# EAGLE design Final Schematic (EAGLE 7.7.0)
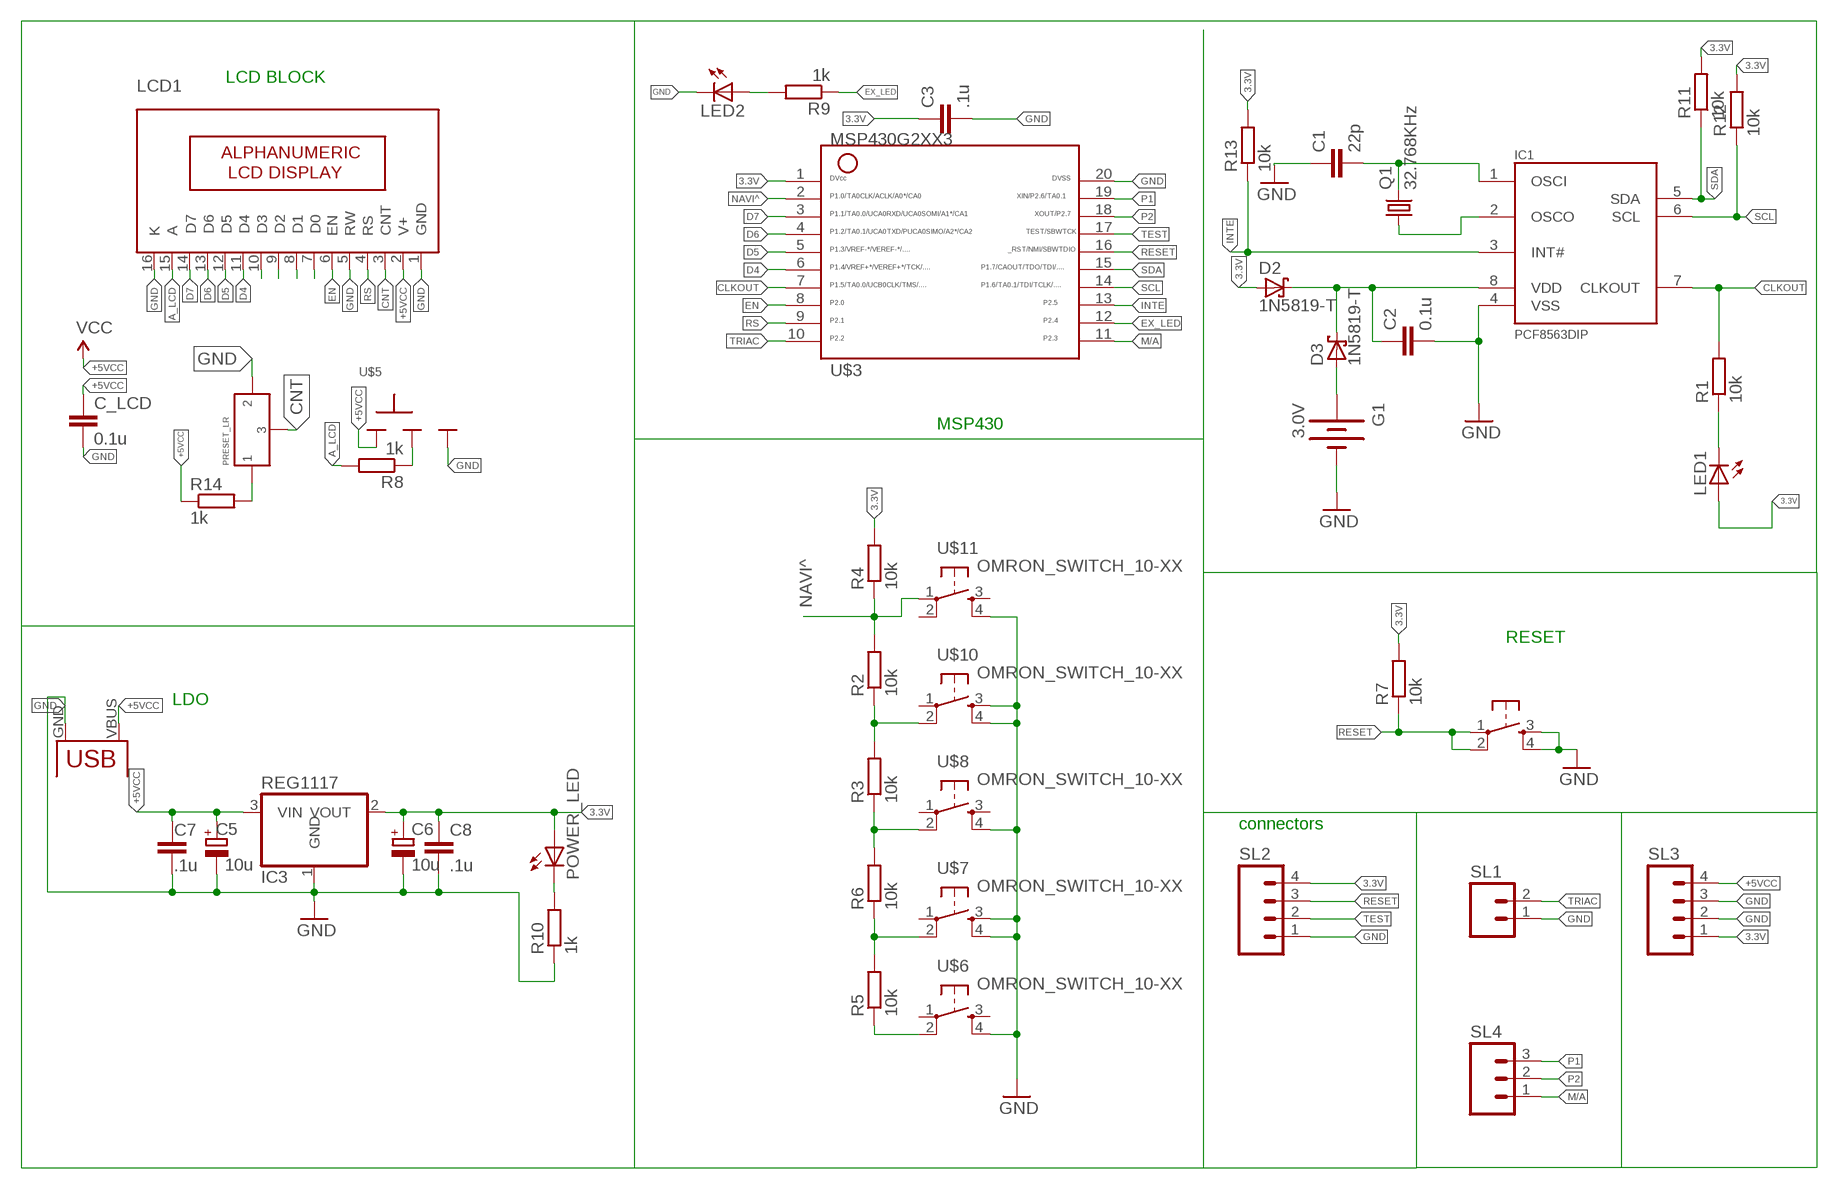
[diagram p0: schematic, sheet 1]

## Parts
C1  22p  C-EU025-025X050  [C025-025X050]
C2  0.1u  C-EU025-025X050  [C025-025X050]
C3  .1u  C-EU025-025X050  [C025-025X050]
C5  10u  CPOL-EUE2.5-5  [E2,5-5]
C6  10u  CPOL-EUE2.5-5  [E2,5-5]
C7  .1u  C-EU025-025X050  [C025-025X050]
C8  .1u  C-EU025-025X050  [C025-025X050]
C_LCD  0.1u  C-EU025-025X050  [C025-025X050]
D2  1N5819-T  [DO41-7.6]
D3  1N5819-T  [DO41-7.6]
G1  3.0V  BATTERY20PTH  [BATTCOM_20MM_PTH]
IC1  PCF8563DIP  [DIL08]
IC3  REG1117  [SOT223]
LCD1  16X2LCD  [16X2_LCD]
LED1  LED3MM  [LED3MM]
LED2  LED3MM  [LED3MM]
POWER_LED  LED3MM  [LED3MM]
Q1  32.768KHz  CRYSTALTC26H  [TC26H]
R1  10k  R-EU_0207/7  [0207/7]
R2  10k  R-EU_0207/7  [0207/7]
R3  10k  R-EU_0207/7  [0207/7]
R4  10k  R-EU_0207/7  [0207/7]
R5  10k  R-EU_0207/7  [0207/7]
R6  10k  R-EU_0207/7  [0207/7]
R7  10k  R-EU_0207/7  [0207/7]
R8  1k  R-EU_0207/7  [0207/7]
R9  1k  R-EU_0207/10  [0207/10]
R10  1k  R-EU_0207/7  [0207/7]
R11  10k  R-EU_0207/7  [0207/7]
R12  10k  R-EU_0207/10  [0207/10]
R13  10k  R-EU_0207/7  [0207/7]
R14  1k  R-EU_0207/7  [0207/7]
SL1  M02  [02P]
SL2  M04  [04P]
SL3  M04  [04P]
SL4  M03  [03P]
U$1  PRESET_LR  [PRESET_LR]
U$2  USB(POWER)  [USB(POWER)]
U$3  MSP430G2553DIP20  [G2553-DIP20]
U$5  SLIDESWITCH-BIG  [BIGSWITCH]
U$6  OMRON_SWITCH_10-XX  [B3F-10XX]
U$7  OMRON_SWITCH_10-XX  [B3F-10XX]
U$8  OMRON_SWITCH_10-XX  [B3F-10XX]
U$9  OMRON_SWITCH_10-XX  [B3F-10XX]
U$10  OMRON_SWITCH_10-XX  [B3F-10XX]
U$11  OMRON_SWITCH_10-XX  [B3F-10XX]

## Nets
3.3V: C3.1 C6.+ C8.1 D2.A IC3.2(VOUT) LED1.A POWER_LED.A R4.2 R7.2 R11.2 R12.2 R13.2 SL2.4 SL3.1 U$3.1
+5VCC: C5.+ C7.1 C_LCD.1 IC3.3(VIN) LCD1.2(V+) R14.1 SL3.4 U$2.VBUS(VCC) U$5.1 ; supply symbol labelled VCC
A_LCD: LCD1.15(A) R8.2
CLKOUT: IC1.7(CLKOUT) R1.2 U$3.7
CNT: LCD1.3(CNT) U$1.P$3
D4: LCD1.11(D4) U$3.6
D5: LCD1.12(D5) U$3.5
D6: LCD1.13(D6) U$3.4
D7: LCD1.14(D7) U$3.3
EN: LCD1.6(EN) U$3.8
EX_LED: R9.1 U$3.12
GND: C1.1 C2.2 C3.2 C5.- C6.- C7.2 C8.2 C_LCD.2 G1.2(-) IC1.4(VSS) IC3.1(GND) LCD1.1(GND) LCD1.5(RW) LCD1.16(K) LED2.K(C) R10.1 SL1.1 SL2.1 SL3.2 SL3.3 U$1.P$2 U$2.GND U$3.20 U$5.3 U$6.4(S1) U$7.3(S) U$7.4(S1) U$8.4(S1) U$9.3(S) U$9.4(S1) U$10.3(S) U$10.4(S1) U$11.4(S1)
INTE: IC1.3(INT#) R13.1 U$3.13
M/A: SL4.1 U$3.11
N$1: R8.1 U$5.2
N$3: LED2.A R9.2
N$5: LED1.K(C) R1.1
N$6: R14.2 U$1.P$1
N$10: R5.1 U$6.2(P1)
N$13: R2.1 R3.2 U$10.2(P1)
N$14: POWER_LED.K(C) R10.2
N$16: R3.1 R6.2 U$8.2(P1)
N$17: C2.1 D2.C D3.C IC1.8(VDD)
N$18: C1.2 IC1.1(OSCI) Q1.2
N$19: IC1.2(OSCO) Q1.1
N$20: D3.A G1.1(+)
N$21: LCD1.10(D3)
N$22: LCD1.9(D2)
N$23: LCD1.8(D1)
N$24: LCD1.7(D0)
N$25: R5.2 R6.1 U$7.2(P1)
NAVI^: R2.2 R4.1 U$3.2 U$11.1(P)
P1: SL4.3 U$3.19
P2: SL4.2 U$3.18
RESET: R7.1 SL2.3 U$3.16 U$9.1(P) U$9.2(P1)
RS: LCD1.4(RS) U$3.9
SCL: IC1.6(SCL) R12.1 U$3.14
SDA: IC1.5(SDA) R11.1 U$3.15
TEST: SL2.2 U$3.17
TRIAC: SL1.2 U$3.10
Unconnected: U$6.1(P) U$6.3(S) U$7.1(P) U$8.1(P) U$8.3(S) U$10.1(P) U$11.2(P1) U$11.3(S)

## Notes on the sheet
- LCD BLOCK
- MSP430
- RESET
- LDO
- connectors

## Library data of the parts
C1 C2 = rcl:C-EU: CAPACITOR, European symbol
C3 C7 C8 C_LCD = cpo_sdjhjasjhasjf:C-EU: CAPACITOR, European symbol
C5 C6 = cpo_sdjhjasjhasjf:CPOL-EU: POLARIZED CAPACITOR, European symbol
D2 D3 = diode:1N581*: 1.0A SCHOTTKY BARRIER RECTIFIER Source: http://www.diodes.com/datasheets/ds23001.pdf
G1 = SparkFun-Electromechanical:BATTERY: Battery Holders Various common sizes : AA, AAA, 18650 (PRT-12895), 20mm coin cell and 12mm coin cell. 20MM_4LEGS, BATT-10373
IC1 = CEDT_JANUARY_2015_v5:PCF8563
IC3 = CEDT_JANUARY_2015_v5:REG1117: 800mA and 1A Low Dropout (LDO) Positive Regulator 1.8V, 2.5V, 2.85V, 3.3V, 5V, and Adj
LCD1 = CEDT_JANUARY_2015_v5:16X2LCD: ALPHANUMERIC-LCD
LED1 = cpo_sdjhjasjhasjf:LED
LED2 POWER_LED = CEDT_JANUARY_2015_v5:LED
Q1 = CEDT_JANUARY_2015_v5:CRYSTAL: Crystals Various standard crystals. Proven footprints. Spark Fun Electronics SKU : COM-00534
R1-R7 R9-R13 = resistor:R-EU_: RESISTOR, European symbol
R8 = cpo_sdjhjasjhasjf:R-EU_: RESISTOR, European symbol
R14 = code practice oscillator:R-EU_: RESISTOR, European symbol
SL1 = con-amp-quick:M02: AMP QUICK CONNECTOR; OC_FARNELL: unknown; OC_NEWARK: unknown
SL2 SL3 = con-amp-quick:M04: AMP QUICK CONNECTOR; OC_FARNELL: unknown; OC_NEWARK: unknown
SL4 = con-amp-quick:M03: AMP QUICK CONNECTOR; OC_FARNELL: unknown; OC_NEWARK: unknown
U$1 = CEDT_JANUARY_2015_v5:PRESET_LR
U$2 = CEDT_JANUARY_2015_v5:USB(POWER)
U$3 = CEDT_JANUARY_2015_v5:MSP430G2553
U$5 = CEDT_JANUARY_2015_v5:SLIDESWITCH
U$6-U$8 U$10 U$11 = cpo_sdjhjasjhasjf:OMRON_SWITCH
U$9 = CEDT_JANUARY_2015_v5:OMRON_SWITCH

## Board
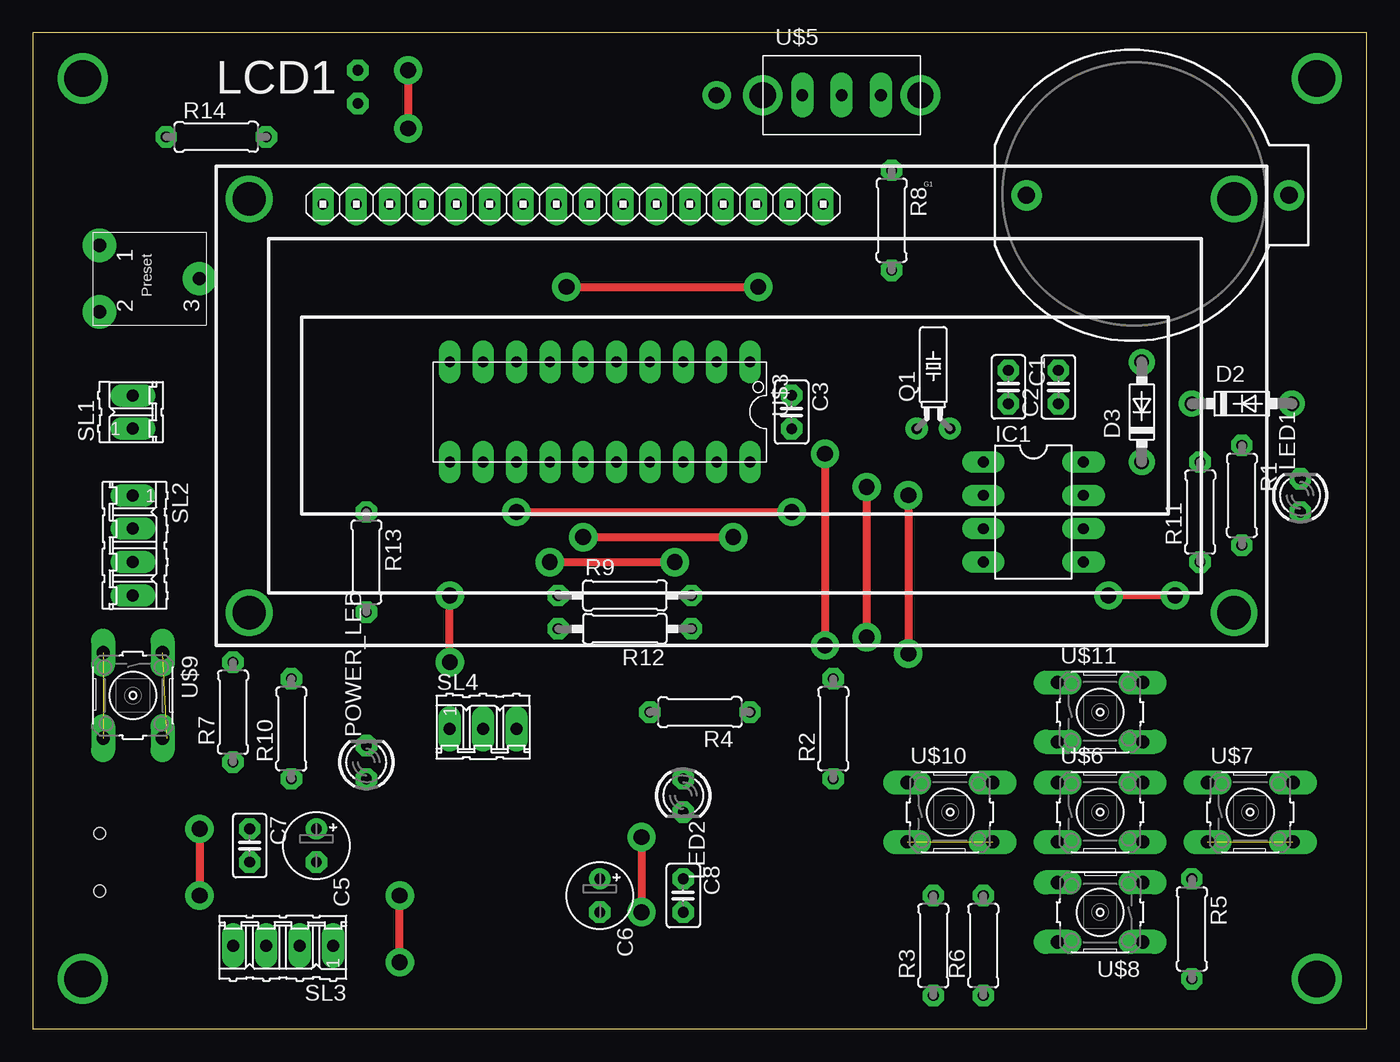
[diagram p1: board, top side]
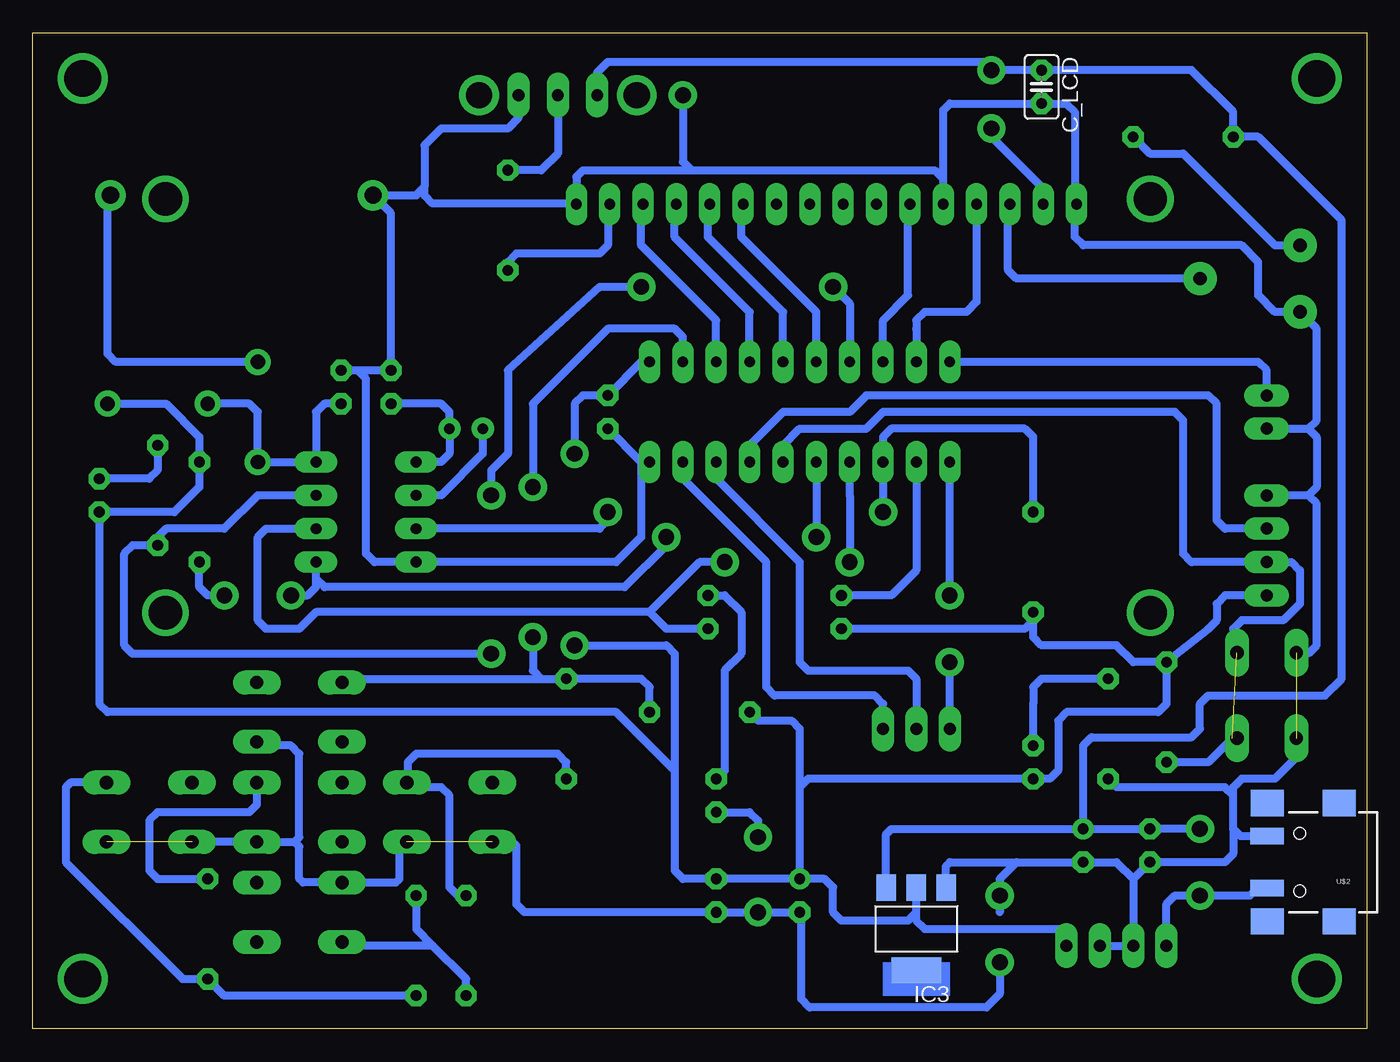
[diagram p2: board, bottom side, seen from below]

Size 101.58 x 75.87 mm. Coordinates in mm from the lower left corner, seen from the top.
Outline: 0,0 101.58,0 101.58,75.87 0,75.87 0,0
Copper layers (1*16): Top 0.035mm / dielectric 1.5mm / Bottom 0.035mm
Design rules "default *": minimum track width 16mil, minimum drill 24mil, track to track 16mil, track to pad 16mil, pad to pad 16mil, via to via 16mil, smd to smd 8mil, copper to edge 40mil, drill to drill 8mil, minimum pad ring 16mil, minimum via ring 16mil, stop-mask expansion 4mil, vias tented up to drill 0mil, thermal gap 10mil

### Footprints (pad centres in the part's own frame; a part is rotated, then mirrored left to right if it is on the bottom)
C025-025X050 = drill 0.813 octagon: 1 -1.27,0; 2 1.27,0
E2,5-5 = drill 0.813 pad 1.6: + -1.27,0 | drill 0.813 pad 1.6 octagon: - 1.27,0
DO41-7.6 = drill 1.1 pad 1.7: A 3.81,0; C -3.81,0
BATTCOM_20MM_PTH = drill 1.3: 1 11.85,0; 2 -8.15,0
DIL08 = drill 0.813 long: 1 -3.81,-3.81; 2 -1.27,-3.81; 3 1.27,-3.81; 4 3.81,-3.81; 5 3.81,3.81; 6 1.27,3.81; 7 -1.27,3.81; 8 -3.81,3.81
SOT223 = smd 1.499 x 2.007: 1 -2.261,-3.15; 2 0.025,-3.15; 3 2.311,-3.15 | smd 3.81 x 2.007: 4 0,3.15
16X2_LCD = drill 0.813 long: 1 8.12,33.608; 2 10.66,33.608; 3 13.2,33.608; 4 15.74,33.608; 5 18.28,33.608; 6 20.82,33.608; 7 23.36,33.608; 8 25.9,33.608; 9 28.44,33.608; 10 30.98,33.608; 11 33.52,33.608; 12 36.06,33.608; 13 38.6,33.608; 14 41.14,33.608; 15 43.68,33.608; 16 46.22,33.608 | drill 2.54: P$1 2.5,34; P$2 2.5,2.5; P$3 77.5,2.5; P$4 77.5,34
LED3MM = drill 0.813 octagon: A -1.27,0; K 1.27,0
TC26H = drill 0.813 pad 1.676: 1 -1.27,0; 2 1.27,0
0207/7 = drill 0.813 octagon: 1 -3.81,0; 2 3.81,0
0207/10 = drill 0.813 octagon: 1 -5.08,0; 2 5.08,0
02P = drill 0.914 long: 1 -1.27,0; 2 1.27,0
04P = drill 0.914 long: 1 -3.81,0; 2 -1.27,0; 3 1.27,0; 4 3.81,0
03P = drill 0.914 long: 1 -2.54,0; 2 0,0; 3 2.54,0
PRESET_LR = drill 1.016 pad 2.54: P$1 -2.54,-3.81; P$2 2.54,-3.81; P$3 0,3.81
USB(POWER) = smd 2.54 x 1.27: GND 2.5,-1.981; VBUS 2.5,1.981 | smd 2.5 x 2: GND@1 -3,-4.5; GND@2 -3,4.5; GND@3 2.5,4.5; GND@4 2.5,-4.5 | hole 0.9: 0,2.2; 0,-2.2
G2553-DIP20 = drill 0.813 long: 1 -10.165,-3.81; 2 -7.625,-3.81; 3 -5.085,-3.81; 4 -2.545,-3.81; 5 -0.005,-3.81; 6 2.535,-3.81; 7 5.075,-3.81; 8 7.615,-3.81; 9 10.155,-3.81; 10 12.695,-3.81; 11 12.695,3.81; 12 10.155,3.81; 13 7.615,3.81; 14 5.075,3.81; 15 2.535,3.81; 16 -0.005,3.81; 17 -2.545,3.81; 18 -5.085,3.81; 19 -7.625,3.81; 20 -10.165,3.81
BIGSWITCH = drill 0.9 long: 1 -3,0; 2 0,0; 3 3,0 | drill 2 pad 2.184: TAB1 -6,0; TAB2 6,0
B3F-10XX = drill 1.016 long: 1 -3.251,2.261; 2 3.251,2.261; 3 -3.251,-2.261; 4 3.251,-2.261

### Placement (x,y rotation side)
C1  74.3,48.9 270 top
C2  78.11,48.9 90 top
C3  57.78,46.99 270 top
C5  21.59,13.97 270 top
C6  43.18,10.16 270 top
C7  16.51,13.97 270 top
C8  49.53,10.16 270 top
C_LCD  24.77,71.75 270 bottom
D2  92.08,47.62 0 top
D3  84.45,46.99 90 top
G1  83.82,63.5 0 top
IC1  76.2,39.37 270 top
IC3  34.29,7.62 180 bottom
LCD1  13.97,29.21 0 top
LED1  96.52,40.64 90 top
LED2  49.53,17.78 270 top
POWER_LED  25.4,20.32 90 top
Q1  68.58,45.72 0 top
R1  92.08,40.64 270 top
R2  60.96,22.86 90 top
R3  68.58,6.35 90 top
R4  50.8,24.13 180 top
R5  88.27,7.62 270 top
R6  72.39,6.35 90 top
R7  15.24,24.13 90 top
R8  65.41,61.59 270 top
R9  45.09,33.02 0 top
R10  19.68,22.86 90 top
R11  88.9,39.37 90 top
R12  45.09,30.48 180 top
R13  25.4,35.56 270 top
R14  13.97,67.94 0 top
SL1  7.62,46.99 90 top
SL2  7.62,36.83 270 top
SL3  19.05,6.35 180 top
SL4  34.29,22.86 0 top
U$1  8.89,57.15 270 top
U$2  5.08,12.7 180 bottom
U$3  44.45,46.99 180 top
U$5  61.59,71.12 0 top
U$6  81.28,16.51 0 top
U$7  92.71,16.51 0 top
U$8  81.28,8.89 180 top
U$9  7.62,25.4 270 top
U$10  69.85,16.51 0 top
U$11  81.28,24.13 0 top

### Tracks (layer width: path | path; a pad name or v marks a point on that pad's centre or on a via)
3.3V  (via drill 1.2 pad 1.93)
  Top 0.61: v60.33,43.81 v60.33,29.21
  Bottom 0.61: IC3.2 34.31,8.87 | 34.31,8.87 34.92,8.26 40.01,8.26 40.64,8.89 40.64,10.79 41.27,11.43 C6.+ | SL3.1 22.86,6.99 | 22.86,6.99 22.86,7.62 | 43.18,18.41 42.55,19.05 POWER_LED.A 24.13,19.05 23.5,19.68 23.5,23.5 22.86,24.13 15.88,24.13 15.24,24.77 R7.2 | 43.18,18.41 C6.+ | SL2.4 10.79,33.02 11.43,32.38 11.43,31.11 12.06,30.48 R7.2 | R7.2 17.78,27.94 19.05,29.21 24.77,29.21 25.4,29.84 R13.2 25.4,31.11 26.04,30.48 R12.2 | U$3.1 55.24,50.8 C3.1 59.69,48.26 60.33,47.62 v60.33,43.81 | C6.+ C8.1 52.07,11.43 52.7,12.06 52.7,19.68 | v60.33,29.21 53.34,29.21 52.7,28.57 52.7,19.68 | R4.2 46.35,23.5 43.81,23.5 43.18,22.86 43.18,18.41 | 52.7,19.68 57.15,24.13 95.89,24.13 96.52,24.77 LED1.A 90.81,39.37 88.9,41.27 R11.2 88.9,45.09 91.44,47.62 D2.A | 22.86,6.99 23.5,7.62 33.66,7.62 34.31,8.28 34.31,8.87
+5VCC  (via drill 1.2 pad 1.93)
  Top 0.61: v28.57,73.03 v28.57,68.58 | v12.7,15.24 v12.7,10.16
  Bottom 0.61: v12.7,15.24 C7.1 C5.+ | IC3.3 36.6,14.83 36.2,15.24 C5.+ | C5.+ 21.59,21.59 20.95,22.23 13.34,22.23 12.7,22.86 12.7,24.77 12.06,25.4 3.17,25.4 1.91,26.67 1.91,61.59 8.26,67.94 R14.1 10.16,69.85 13.34,73.03 C_LCD.1 v28.57,73.03 29.21,73.66 57.78,73.66 58.59,72.85 U$5.1 | v28.57,68.58 28.57,67.94 24.77,64.14 24.77,62.95 LCD1.2 | U$2.VBUS 7.66,10.79 8.26,10.79 8.89,10.16 v12.7,10.16 14.61,10.16 15.24,9.53 SL3.4
A_LCD
  Bottom 0.61: LCD1.15 57.78,62.95 57.78,59.69 58.42,59.05 64.77,59.05 65.41,58.42 R8.2
CLKOUT  (via drill 1.2 pad 1.93)
  Top 0.61: v40.64,56.52 v55.24,56.52 | v66.67,40.64 v66.67,28.57
  Bottom 0.61: v40.64,56.52 39.37,55.24 U$3.7 | v66.67,40.64 66.67,42.55 65.41,43.81 65.41,50.16 58.42,56.52 v55.24,56.52 | v66.67,28.57 93.98,28.57 94.61,29.21 94.61,36.2 93.98,36.83 R1.2 92.08,37.47 91.44,38.1 87,38.1 84.45,40.64 IC1.7
CNT
  Bottom 0.61: U$1.P$3 26.67,57.15 27.3,57.78 27.3,62.68 LCD1.3
D4
  Bottom 0.61: U$3.6 41.91,54.62 47.62,60.33 47.62,62.68 LCD1.11
D5
  Bottom 0.61: U$3.5 44.45,54.6 44.45,54.61 50.16,60.33 50.16,62.68 LCD1.12
D6
  Bottom 0.61: U$3.4 46.99,54.62 52.7,60.33 52.7,62.68 LCD1.13
D7
  Bottom 0.61: U$3.3 49.53,53.98 55.24,59.69 55.24,62.68 LCD1.14
EN
  Bottom 0.61: U$3.8 36.84,53.97 34.92,55.88 34.92,62.68 LCD1.6
EX_LED
  Bottom 0.61: U$3.12 34.3,34.92 36.2,33.02 R9.1
GND  (via drill 1.2 pad 1.93)  (3 unrouted)
  Top 0.61: v46.35,14.61 v46.35,8.89 | v27.94,5.08 v27.94,10.16
  Bottom 0.61: 4.45,40.64 3.81,40.01 3.81,29.21 4.37,28.65 U$9.3 | 4.45,40.64 SL2.1 | SL3.2 SL3.3 17.78,11.43 | SL1.1 4.45,45.72 | 4.45,45.72 3.81,46.35 3.81,53.34 U$1.P$2 6.99,54.61 8.26,55.88 8.26,58.42 9.53,59.69 21.59,59.69 22.23,60.33 22.23,62.68 LCD1.1 22.23,62.95 22.23,69.85 22.86,70.48 C_LCD.2 31.75,70.48 32.25,69.98 32.25,64.77 | 4.45,45.72 3.81,45.09 3.81,41.27 4.45,40.64 | C2.2 76.83,50.16 | 76.83,50.16 74.93,50.16 | 74.93,50.16 C1.1 | 76.83,50.16 76.2,49.53 76.2,36.2 75.56,35.56 IC1.4 57.15,35.56 55.24,37.47 55.24,43.18 | 81.64,14.25 U$6.4 U$7.3 | U$11.4 82.98,21.59 81.92,21.59 81.28,20.95 81.28,14.61 81.64,14.25 | U$3.20 55.24,43.18 | 55.24,43.18 C3.2 | LED2.K 46.99,16.51 46.35,15.88 v46.35,14.61 | 17.78,11.43 C7.2 10.79,12.7 10.16,13.34 10.16,15.24 | 26.67,12.7 C5.- 19.05,12.7 17.78,11.43 | 27.94,8.89 v27.94,10.16 27.94,11.43 26.67,12.7 | v27.94,5.08 27.94,2.67 28.96,1.65 42.42,1.65 43.05,2.29 43.05,8.76 C6.- v46.35,8.89 C8.2 64.14,8.89 64.77,9.53 64.77,13.97 65.05,14.25 U$10.3 | 81.64,14.25 81.28,13.89 81.28,11.43 81,11.15 U$8.4 73.94,11.15 73.66,11.43 73.66,13.69 U$10.4 | IC3.1 32.03,12.42 31.75,12.7 26.67,12.7 | 74.93,50.16 74.3,50.8 74.3,62.12 G1.2 72.39,63.5 71.75,64.14 | 71.75,64.14 71.75,67.31 70.48,68.58 65.41,68.58 64.59,69.39 U$5.3 | LCD1.16 60.19,63 | 51.44,65.41 59.69,65.41 60.19,64.91 60.19,63 | v52.07,71.12 52.07,66.04 51.44,65.41 | 60.19,63 60.33,62.87 71.12,62.87 71.75,63.5 71.75,64.14 | LCD1.5 32.25,64.77 | 51.44,65.41 32.88,65.41 32.25,64.77 | U$9.4 5.36,20.68 6.99,19.05 9.53,19.05 10.16,18.41 10.16,17.78 | U$2.GND 9.6,14.68 10.16,15.24 | R10.1 19.05,18.41 10.79,18.41 10.16,17.78
  Bottom 0.61: 10.16,15.24 10.16,17.78
INTE  (via drill 1.2 pad 1.93)
  Top 0.61: v36.83,39.37 v57.78,39.37
  Bottom 0.61: R13.1 25.4,45.09 26.04,45.72 36.2,45.72 36.83,45.09 U$3.13 36.84,40.65 36.83,40.64 v36.83,39.37 | IC1.3 58.42,38.1 57.78,38.73 v57.78,39.37
M/A  (via drill 1.2 pad 1.93)
  Top 0.61: v31.75,27.94 v31.75,33.02
  Bottom 0.61: SL4.1 v31.75,27.94 | v31.75,33.02 U$3.11
N$1
  Bottom 0.61: U$5.2 61.59,66.67 62.87,65.41 R8.1
N$2  (via drill 2.8 pad 3.81)
  other vias: 3.81,72.39
N$3
  Bottom 0.61: LED2.A 48.9,19.68 48.9,27.3 47.62,28.57 47.62,31.75 48.9,33.02 R9.2
N$4  (via drill 2.8 pad 3.81)
  other vias: 97.79,72.39
N$5
  Bottom 0.61: R1.1 92.08,42.55 92.71,41.91 LED1.K
N$6
  Bottom 0.61: R14.2 16.51,66.67 13.97,66.67 6.99,59.69 U$1.P$1
N$7  (via drill 2.8 pad 3.81)
  other vias: 97.79,3.81
N$9  (via drill 2.8 pad 3.81)
  other vias: 3.81,3.81
N$10
  Bottom 0.61: U$6.2 84.53,17.07 85.09,16.51 92.08,16.51 92.71,15.88 92.71,12.06 92.08,11.43 R5.1
N$13
  Bottom 0.61: R3.2 69.22,10.16 69.85,10.79 69.85,17.78 70.48,18.41 72.75,18.41 U$10.2 73.03,18.85 73.03,20.32 72.39,20.95 61.59,20.95 60.96,20.32 R2.1
N$14
  Bottom 0.61: POWER_LED.K 25.4,24.13 25.4,24.77 25.4,26.04 24.77,26.67 R10.2
N$16
  Bottom 0.61: R3.1 68.58,3.81 71.12,6.35 | R6.2 72.39,7.62 71.12,6.35 | 71.12,6.35 76.48,6.35 U$8.2
N$17
  Bottom 0.61: C2.1 79.38,47.62 80.01,46.99 IC1.8 D3.C 84.45,46.99 85.09,47.62 D2.C
N$18
  Bottom 0.61: IC1.1 70.48,43.18 69.85,43.81 Q1.2 69.85,46.99 70.48,47.62 C1.2
N$19
  Bottom 0.61: IC1.2 70.48,40.64 67.31,43.81 Q1.1
N$20
  Bottom 0.61: D3.A 95.25,50.8 95.89,51.44 95.89,63.28 G1.1
N$25
  Bottom 0.61: R6.1 87,2.54 R5.2 90.17,3.81 99.06,12.7 99.06,18.41 98.7,18.77 U$7.2
NAVI^  (via drill 1.2 pad 1.93)
  Top 0.61: v63.5,41.27 v63.5,29.84
  Bottom 0.61: U$11.1 76.48,26.67 62.87,26.67 | U$3.2 52.08,52.71 52.7,53.34 57.78,53.34 63.5,47.62 v63.5,41.27 | 62.87,26.67 R2.2 55.24,26.67 54.61,26.04 R4.1 | v63.5,29.84 63.5,27.3 62.87,26.67
P1
  Bottom 0.61: U$3.19 52.07,41.91 45.72,35.56 45.72,26.04 45.09,25.4 37.47,25.4 36.83,24.77 SL4.3
P2
  Bottom 0.61: U$3.18 49.53,41.91 43.18,35.56 43.18,27.94 42.55,27.3 34.92,27.3 34.29,26.67 SL4.2
RESET  (1 unrouted)
  Bottom 0.61: U$9.1 10.16,28.93 10.16,30.48 9.53,31.11 6.35,31.11 5.08,32.38 5.08,34.92 5.71,35.56 SL2.3 13.34,35.56 13.97,36.2 13.97,46.35 14.61,46.99 36.83,46.99 38.1,45.72 43.18,45.72 44.45,44.45 U$3.16 | U$9.2 10.24,22.15 12.06,20.32 R7.1
RS
  Bottom 0.61: LCD1.4 29.71,55.38 30.48,54.61 33.66,54.61 34.29,53.98 34.29,53.34 34.29,52.07 U$3.9
SCL  (via drill 1.2 pad 1.93)
  Top 0.61: v39.37,35.56 v48.9,35.56
  Bottom 0.61: U$3.14 39.38,40.65 39.37,40.64 v39.37,35.56 | IC1.6 83.82,38.1 84.45,37.47 84.45,31.11 83.82,30.48 81.28,30.48 80.01,31.75 54.61,31.75 | v48.9,35.56 50.8,35.56 54.61,31.75 | R12.1 53.34,30.48 54.61,31.75
SDA  (via drill 1.2 pad 1.93)
  Top 0.61: v41.91,37.47 v53.34,37.47 | v87,33.02 v81.92,33.02
  Bottom 0.61: U$3.15 v41.91,37.47 | 80.01,34.29 80.01,33.66 80.64,33.02 v81.92,33.02 | 80.01,34.29 IC1.5 | v53.34,37.47 53.34,36.83 56.52,33.66 79.38,33.66 80.01,34.29 | v87,33.02 88.27,33.02 88.9,33.66 R11.1
TEST
  Bottom 0.61: SL2.2 10.79,38.1 11.43,38.73 11.43,47.62 12.06,48.26 38.1,48.26 39.37,46.99 44.45,46.99 46.99,44.45 U$3.17
TRIAC
  Bottom 0.61: SL1.2 7.62,50.16 8.26,50.8 U$3.10
(copper drawn outside any net)
  shapes: Bottom area x1